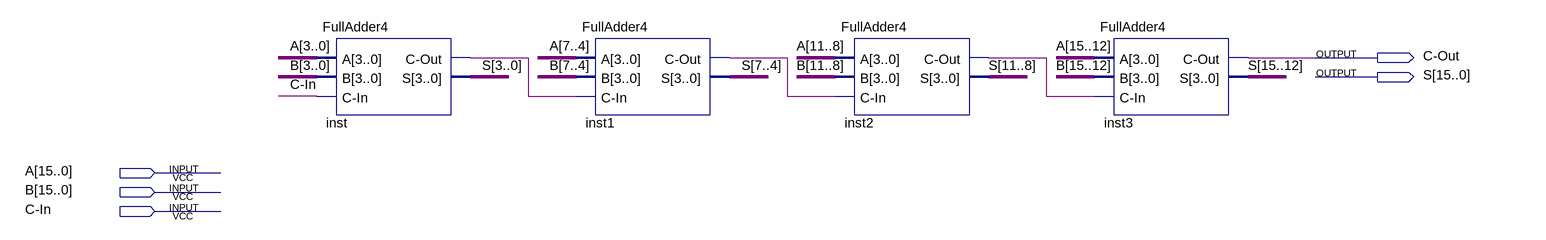
[diagram p0: schematic sheet]
// Quartus schematic FullAdder16.bdf as structural Verilog: 4 symbols, 5 pins
module FullAdder16 (
  input  [15:0] A,
  input  [15:0] B,
  input  \C-In ,
  output \C-Out ,
  output [15:0] S
);

  wire inst1_c_out, inst2_c_out, inst_c_out;

  FullAdder4 inst (.A(A[3:0]), .B(B[3:0]), .\C-In (\C-In ), .\C-Out (inst_c_out), .S(S[3:0]));
  FullAdder4 inst1 (.A(A[7:4]), .B(B[7:4]), .\C-In (inst_c_out), .\C-Out (inst1_c_out), .S(S[7:4]));
  FullAdder4 inst2 (.A(A[11:8]), .B(B[11:8]), .\C-In (inst1_c_out), .\C-Out (inst2_c_out), .S(S[11:8]));
  FullAdder4 inst3 (.A(A[15:12]), .B(B[15:12]), .\C-In (inst2_c_out), .\C-Out (\C-Out ), .S(S[15:12]));
endmodule
